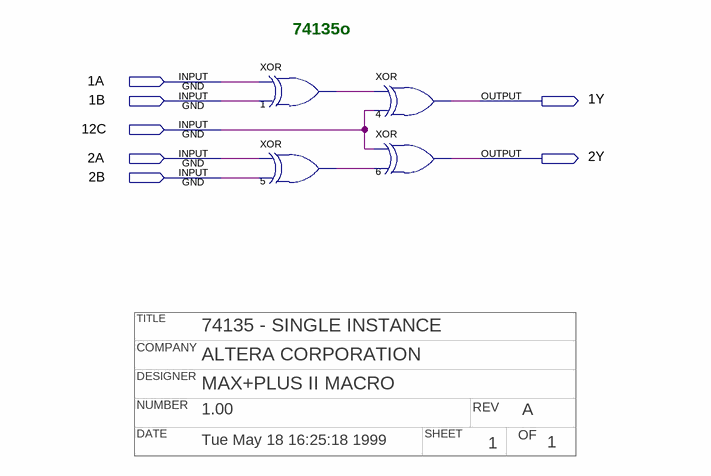
[diagram p0: schematic sheet]
// Quartus schematic 74135o.bdf as structural Verilog: 4 symbols, 7 pins
// Title block: TITLE: 74135 - SINGLE INSTANCE; COMPANY: ALTERA CORPORATION; DESIGNER: MAX+PLUS II MACRO; NUMBER: 1.00; REV: A; DATE: Tue May 18 16:25:18 1999; SHEET: 1; OF: 1
module \74135o  (
  input  \1A ,
  input  \1B ,
  input  \12C ,
  input  \2A ,
  input  \2B ,
  output \1Y ,
  output \2Y 
);

  wire n1_out, n5_out;

  xor u_1 (n1_out, \1A , \1B );
  xor u_5 (n5_out, \2A , \2B );
  xor u_4 (\1Y , n1_out, \12C );
  xor u_6 (\2Y , \12C , n5_out);

  // Notes on the sheet:
  //   74135o
endmodule
